# Altium schematic sheet PowerSupply.SchDoc
size A4; SheetNumber: 4; SheetTotal: 6; SPICEModelCacheOLNMVHDA: <root> / <DocumentId>OLNMVHDA</DocumentId> / <CacheFrame Number="0"> / <Model Name="led0" Kind="MDL"> / <Text>*Typ INFRARED GaAs LED: Vf=1.2V Vr=5V If=40mA trr=3uS / *LED Pinout: 1=A, 2=K / .MODEL LED0 D (IS=93.5P RS=84M N=2.63 BV=5 IBV=10U / + CJO=2.97P VJ=.75 M=.333 TT=4.32U)</Text> / </Model> / <Model Name="skydiode" Kind="MDL"> / <Text>*Default Schottky Diode / *Schottky Diode Pinout: A,K / .MODEL SKYDIODE D(EG=0.69 XTI=2)</Text> / </Model> / </CacheFrame> / </root>
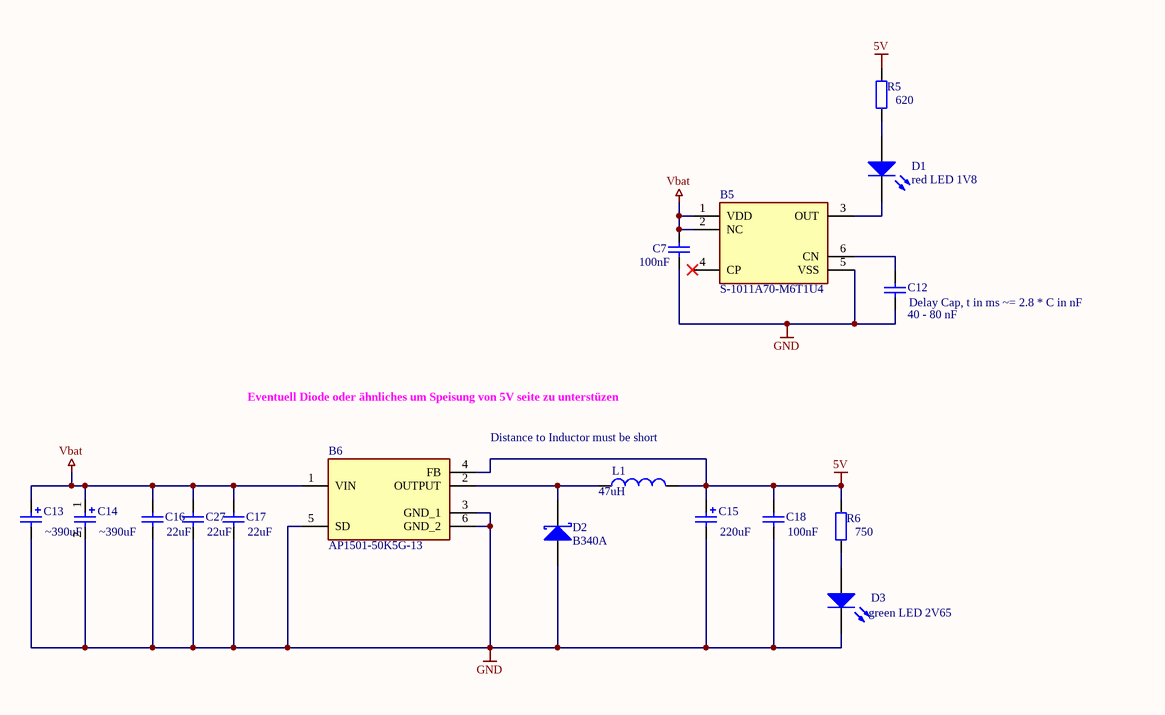
[diagram p0: PowerSupply.SchDoc]

## Parts
B5  S-1011A70-M6T1U4  [SOT95P275X135-6N]
B6  AP1501-50K5G-13  [AP150150K5G13]
C7  value 100nF  [0805_Lorin]  (hidden comment: Cap)
C12  value 40 - 80 nF  [0805_Lorin]  (hidden comment: Cap)
C13  value ~390uF  [CAP390uF]  (hidden comment: Cap Pol2)
C14  value ~390uF  [CAP390uF]  (hidden comment: Cap Pol2)
C15  value 220uF  [CAP220uF]  (hidden comment: Cap Pol2)
C16  value 22uF  [0805_Lorin]  (hidden comment: Cap)
C17  value 22uF  [0805_Lorin]  (hidden comment: Cap)
C18  value 100nF  [0805_Lorin]  (hidden comment: Cap)
C27  value 22uF  [0805_Lorin]  (hidden comment: Cap)
D1  red LED 1V8  [LEDC2012X75M]
D2  B340A  [SODFL5226X110M]
D3  green LED 2V65  [LEDC2012X75M]
L1  value 47uH  [Inductor]  (hidden comment: Inductor)
R5  value 620  [0805_Lorin]  (hidden comment: Res2)
R6  value 750  [0805_Lorin]  (hidden comment: Res2)

## Nets
5V: B6.4(FB) C15.1 C18.2 L1.2 R5.2 R6.2
GND: B5.5(VSS) B6.3(GND_1) B6.5(SD) B6.6(GND_2) C7.1 C12.1 C13.2 C14.2 C15.2 C16.1 C17.1 C18.1 C27.1 D2.1(A) D3.2(K)
Vbat: B5.1(VDD) B5.2(NC) B6.1(VIN) C7.2 C13.1 C14.1 C16.2 C17.2 C27.2
NetB5_3: B5.3(OUT) D1.2(K)
NetB5_6: B5.6(CN) C12.2
NetB6_2: B6.2(OUTPUT) D2.2(K) L1.1
NetD1_1: D1.1(A) R5.1
NetD3_1: D3.1(A) R6.1

Not connected (* = marked no-connect by the designer): B5 4(CP)*

## Notes on the sheet
- (near C12) Delay Cap, t in ms ~= 2.8 * C in nF
- Eventuell Diode oder ähnliches um Speisung von 5V seite zu unterstüzen
- Distance to Inductor must be short

## Library data of the parts
B5 = S-1011A70-M6T1U4: Supervisory Circuits VOLTAGE DETECTOR; Manufacturer_Name: ABLIC Inc.; Geometry.Height: 1.35mm; Mouser Part Number: 628-S-1011A70-M6T1U4; Mouser Price/Stock: https://www.mouser.co.uk/ProductDetail/ABLIC/S-1011A70-M6T1U4?qs=sE1HjTVAc2hYS3q6FFCWDQ%3D%3D; Manufacturer_Part_Number: S-1011A70-M6T1U4; Datasheet Link: https://www.digikey.co.uk/en/products/detail/ablic-u-s-a-inc/S-1011A70-M6T1U4/6601814
B6 = AP1501-50K5G-13: IC REG BUCK 5V 3A TO263-5; Manufacturer_Name: Diodes Inc.; Geometry.Height: 4.85mm; Mouser Part Number: 621-AP1501-50K5G-13; Mouser Price/Stock: https://www.mouser.co.uk/ProductDetail/Diodes-Incorporated/AP1501-50K5G-13?qs=oUsD4qhOtFyyLLjAHWqfUw%3D%3D; Manufacturer_Part_Number: AP1501-50K5G-13; Datasheet Link: https://www.diodes.com/assets/Datasheets/AP1501.pdf
C7 C12 C16-C18 C27 = Cap: Capacitor; Published: 8-Jun-2000; LatestRevisionDate: 17-Jul-2002; LatestRevisionNote: Re-released for DXP Platform.; PackageReference: RAD-0.3; Publisher: Altium Limited; PackageDescription: Radial Cap, Thru-Hole; 2 Leads; 0.3 in Pin Spacing
C13-C15 = Cap Pol2: Polarized Capacitor (Axial); Published: 8-Jun-2000; LatestRevisionDate: 17-Jul-2002; LatestRevisionNote: Re-released for DXP Platform.; PackageReference: POLAR0.8; Publisher: Altium Limited; PackageDescription: Polarized Capacitor; 2 Leads
D1 D3 = LED0: Typical INFRARED GaAs LED; Published: 8-Jun-2000; LatestRevisionDate: 08-Jul-2005; LatestRevisionNote: Mech Layer 1 removed.; PackageReference: LED-0; Publisher: Altium Limited; PackageDescription: LED; 2 Leads
D2 = D Schottky: Schottky Diode; Published: 8-Jun-2000; LatestRevisionDate: 17-Jul-2002; LatestRevisionNote: Re-released for DXP Platform.; PackageReference: SMB; Publisher: Altium Limited; PackageDescription: DO-214-AA/SMB; 2 C-Bend Leads; Body 5.3 x 3.6 mm, inc. leads (LxW); Code_JEDEC: DO-214-AA
L1 = Inductor: Code_IEC: 1005; Published: 8-Jun-2000; LatestRevisionDate: 29-May-2009; LatestRevisionNote: IPC-7351 Footprint Added.; PackageReference: 0402-A; Publisher: Altium Limited; PackageDescription: Chip Inductor; Code_JEITA: 0402
R5 R6 = Res2: Resistor; Published: 8-Jun-2000; LatestRevisionDate: 17-Jul-2002; LatestRevisionNote: Re-released for DXP Platform.; PackageReference: AXIAL-0.4; Publisher: Altium Limited; PackageDescription: Axial Device, Thru-Hole; 2 Leads; 0.4 in Pin Spacing